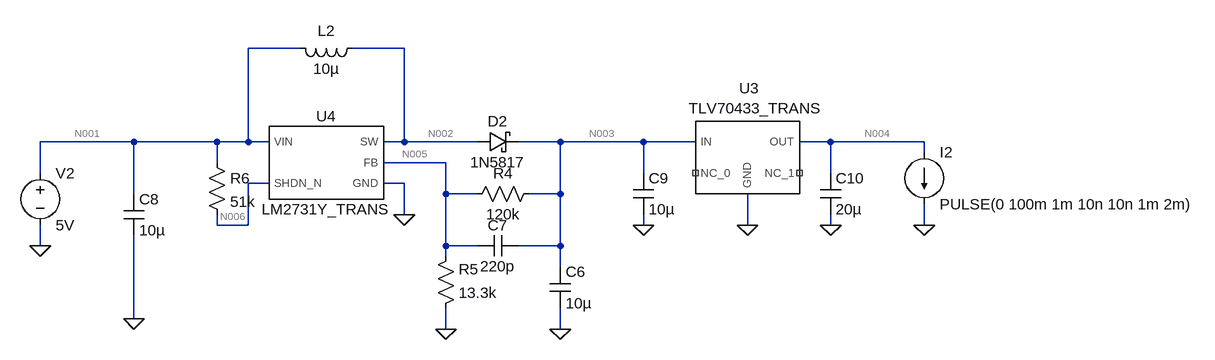
[diagram p0: schematic power_supply.asc]
power_supply.asc, the LTspice schematic file:
Version 4
SHEET 1 1744 680
WIRE 176 -608 96 -608
WIRE 336 -608 256 -608
WIRE -80 -464 -224 -464
WIRE 48 -464 -80 -464
WIRE 96 -464 96 -608
WIRE 96 -464 48 -464
WIRE 128 -464 96 -464
WIRE 336 -464 336 -608
WIRE 336 -464 304 -464
WIRE 448 -464 336 -464
WIRE 576 -464 512 -464
WIRE 704 -464 576 -464
WIRE 784 -464 704 -464
WIRE 992 -464 944 -464
WIRE 1136 -464 992 -464
WIRE 1136 -448 1136 -464
WIRE 48 -432 48 -464
WIRE 400 -432 304 -432
WIRE -224 -416 -224 -464
WIRE 704 -416 704 -464
WIRE 992 -416 992 -464
WIRE 128 -400 96 -400
WIRE 336 -400 304 -400
WIRE -80 -384 -80 -464
WIRE 400 -384 400 -432
WIRE 448 -384 400 -384
WIRE 576 -384 576 -464
WIRE 576 -384 528 -384
WIRE 336 -352 336 -400
WIRE 48 -336 48 -352
WIRE 96 -336 96 -400
WIRE 96 -336 48 -336
WIRE 704 -336 704 -352
WIRE 864 -336 864 -384
WIRE 992 -336 992 -352
WIRE 1136 -336 1136 -368
WIRE -224 -304 -224 -336
WIRE 400 -304 400 -384
WIRE 448 -304 400 -304
WIRE 576 -304 576 -384
WIRE 576 -304 512 -304
WIRE 400 -288 400 -304
WIRE 576 -272 576 -304
WIRE -80 -192 -80 -320
WIRE 400 -176 400 -208
WIRE 576 -176 576 -208
FLAG 400 -176 0
FLAG 576 -176 0
FLAG -80 -192 0
FLAG 336 -352 0
FLAG -224 -304 0
FLAG 1136 -336 0
FLAG 704 -336 0
FLAG 864 -336 0
FLAG 992 -336 0
SYMBOL ind 272 -624 R90
WINDOW 0 5 56 VBottom 2
WINDOW 3 32 56 VTop 2
SYMATTR InstName L2
SYMATTR Value 10µ
SYMBOL schottky 448 -448 R270
WINDOW 0 32 32 VTop 2
WINDOW 3 0 32 VBottom 2
SYMATTR InstName D2
SYMATTR Value 1N5817
SYMATTR Description Diode
SYMATTR Type diode
SYMBOL cap 560 -272 R0
SYMATTR InstName C6
SYMATTR Value 10µ
SYMBOL res 544 -400 R90
WINDOW 0 0 56 VBottom 2
WINDOW 3 32 56 VTop 2
SYMATTR InstName R4
SYMATTR Value 120k
SYMBOL res 384 -192 M180
WINDOW 0 36 76 Left 2
WINDOW 3 36 40 Left 2
SYMATTR InstName R5
SYMATTR Value 13.3k
SYMBOL cap 512 -320 R90
WINDOW 0 0 32 VBottom 2
WINDOW 3 32 32 VTop 2
SYMATTR InstName C7
SYMATTR Value 220p
SYMBOL cap -96 -384 R0
SYMATTR InstName C8
SYMATTR Value 10µ
SYMBOL voltage -224 -432 R0
WINDOW 123 0 0 Left 0
WINDOW 39 0 0 Left 0
SYMATTR InstName V2
SYMATTR Value 5V
SYMBOL res 32 -448 R0
SYMATTR InstName R6
SYMATTR Value 51k
SYMBOL current 1136 -448 R0
WINDOW 123 0 0 Left 0
WINDOW 39 0 0 Left 0
SYMATTR InstName I2
SYMATTR Value PULSE(0 100m 1m 10n 10n 1m 2m)
SYMBOL TLV70433_TRANS 864 -448 R0
SYMATTR InstName U3
SYMBOL cap 688 -416 R0
SYMATTR InstName C9
SYMATTR Value 10µ
SYMBOL cap 976 -416 R0
SYMATTR InstName C10
SYMATTR Value 20µ
SYMBOL LM2731Y_TRANS 208 -432 R0
SYMATTR InstName U4

The netlist it stands for:
* power_supply.asc
L2 N002 N001 10µ
D2 N002 N003 1N5817
C6 N003 0 10µ
R4 N003 N005 120k
R5 0 N005 13.3k
C7 N003 N005 220p
C8 N001 0 10µ
V2 N001 0 5V
R6 N001 N006 51k
I2 N004 0 PULSE(0 100m 1m 10n 10n 1m 2m)
XU3 N003 NC_01 NC_02 N004 0 TLV70433_TRANS  ; pins IN NC_0 NC_1 OUT GND
C9 N003 0 10µ
C10 N004 0 20µ
XU4 N001 N006 N002 N005 0 LM2731Y_TRANS  ; pins VIN SHDN_N SW FB GND
.model D D
.lib standard.dio
.lib D:\Users\javi_\GitHub\Microwatt_Board\Simu_Microwatt_Board\TLV70433_TRANS.LIB
.lib D:\Users\javi_\GitHub\Microwatt_Board\Simu_Microwatt_Board\LM2731Y_TRANS.LIB
.backanno
.end

* Results of the author's LTspice run, read from the files saved beside the schematic
* Operating Point, zero values left out:
*   V(n002) = 5 V
*   V(n001) = 5 V
*   V(n003) = 4.972 V
*   V(n005) = 496.1 mV
*   V(n006) = 4.997 V
*   V(n004) = 3.504 mV
*   I(D2) = 37.81 µA
*   I(L2) = -37.81 µA
*   I(R6) = 49.97 nA
*   I(R5) = -37.3 µA
*   I(R4) = 37.3 µA
*   I(V2) = -37.86 µA
*   Ix(u3:IN) = 508.3 nA
*   Ix(u3:GND) = -16.96 nA
*   Ix(u4:SHDN_N) = 49.97 nA
*   Ix(u4:SW) = 5.01 nA
*   Ix(u4:GND) = -54.98 nA